# EAGLE design Linear-Temperature-Controller-bus-layout (EAGLE 6.5.0)

## Sheet 1 of 2
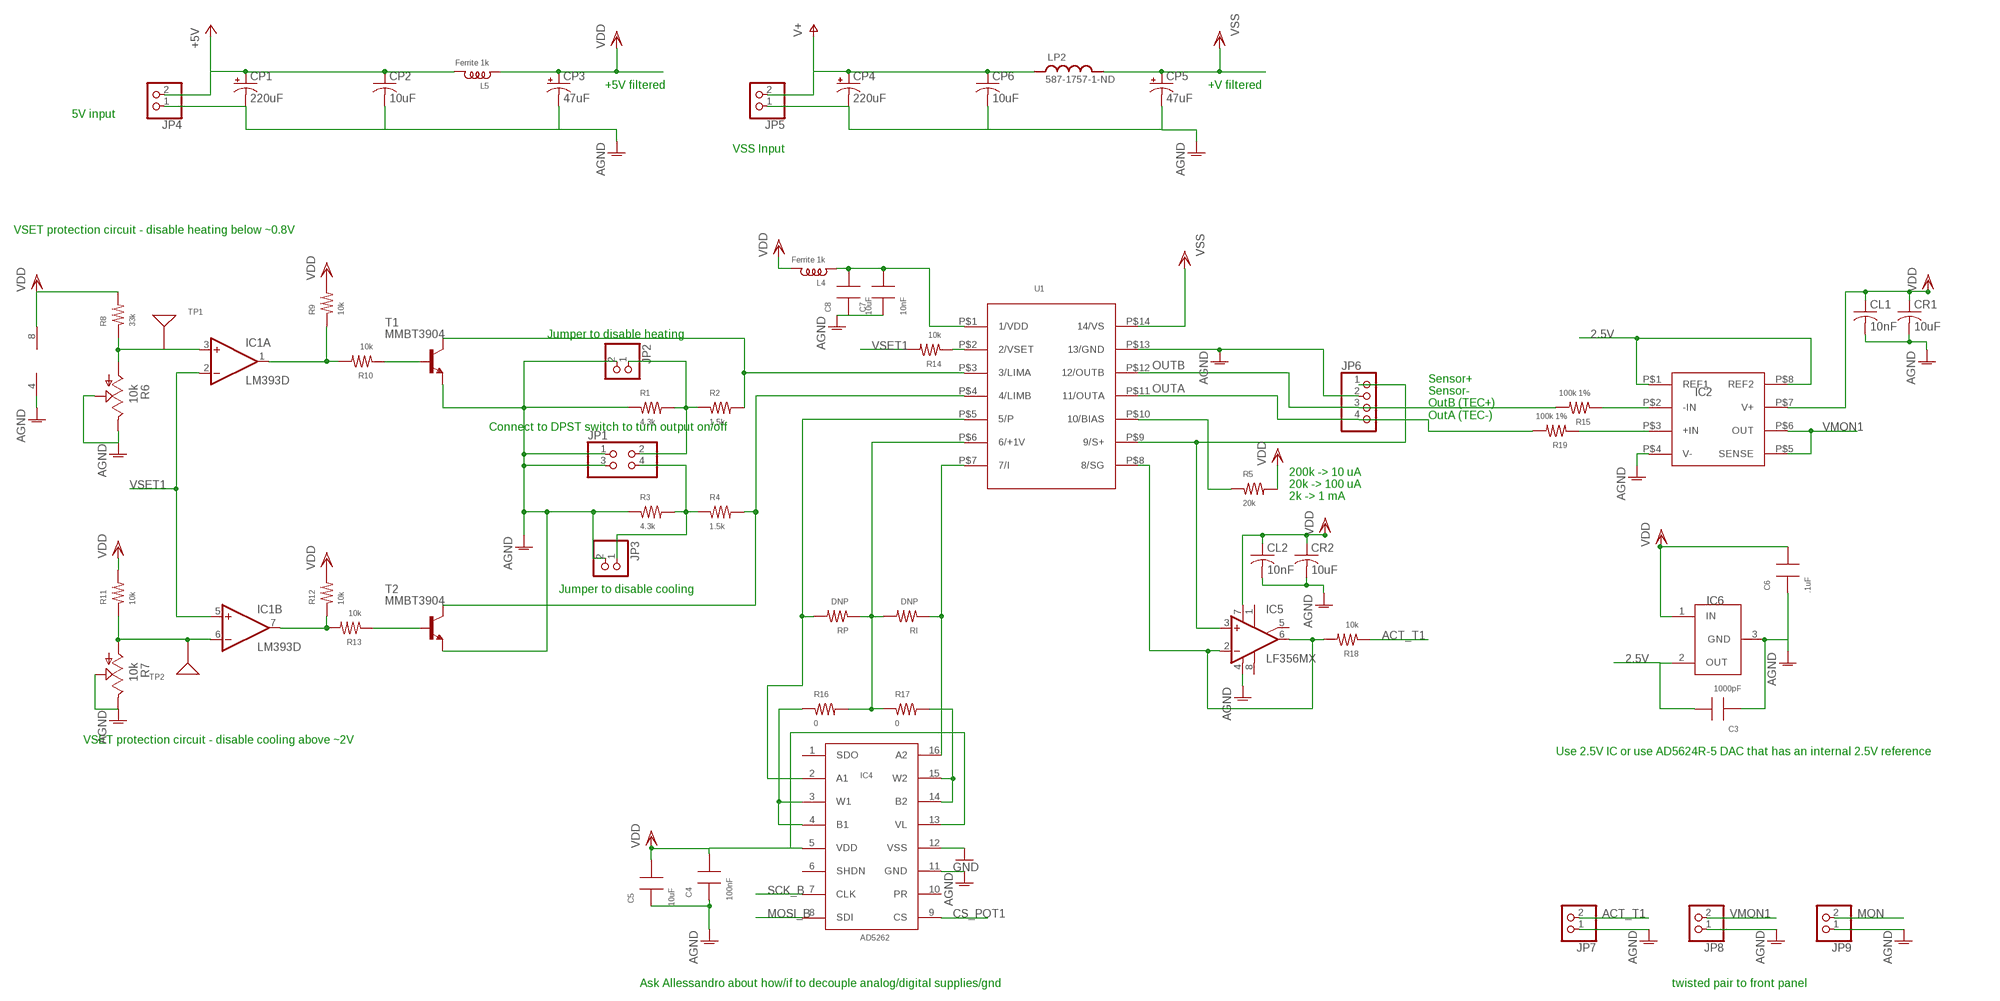
[diagram p0: schematic, sheet 1]

### Parts
C3  1000pF  CAP0805  [0805]
C4  100nF  CAP0805  [0805]
C5  10uF  CAP0805  [0805]
C6  .1uF  CAP0805  [0805]
C7  10nF  CAP0805  [0805]
C8  10uF  CAP0805  [0805]
CL1  10nF  C-USC0805  [C0805]
CL2  10nF  C-USC0805  [C0805]
CP1  220uF  CPOL-USF  [PANASONIC_F]
CP2  10uF  C-USC0805K  [C0805K]
CP3  47uF  CPOL-USCT7343  [CT7343]
CP4  220uF  CPOL-USF  [PANASONIC_F]
CP5  47uF  CPOL-USCT7343  [CT7343]
CP6  10uF  C-USC0805K  [C0805K]
CR1  10uF  C-USC0805  [C0805]
CR2  10uF  C-USC0805  [C0805]
IC1  LM393D  [SO08]
IC2  INA159  [VSSOP8]
IC4  AD5262  [TSSOP16]
IC5  LF356MX  OPAMP-SO  [SO08]
IC6  TS6001  [SOT-23]
JP1  PINHD-2X2  [2X02]
JP2  PINHD-1X2  [1X02]
JP3  PINHD-1X2  [1X02]
JP4  PINHD-1X2  [1X02]
JP5  PINHD-1X2  [1X02]
JP6  PINHD-1X4  [1X04]
JP7  PINHD-1X2  [1X02]
JP8  PINHD-1X2  [1X02]
JP9  PINHD-1X2  [1X02]
L4  Ferrite 1k  INDUCTOR-0805  [0805]
L5  Ferrite 1k  INDUCTOR-0805  [0805]
LP2  587-1757-1-ND  L_FERRITE_SMD  [L_FERRITE_1810]
R1  4.3k  RES0805  [0805]
R2  1.5k  RES0805  [0805]
R3  4.3k  RES0805  [0805]
R4  1.5k  RES0805  [0805]
R5  20k  RES0805  [0805]
R6  10k  64XR  [64XPOT]
R7  10k  64XR  [64XPOT]
R8  33k  RES0805  [0805]
R9  10k  RES0805  [0805]
R10  10k  RES0805  [0805]
R11  10k  RES0805  [0805]
R12  10k  RES0805  [0805]
R13  10k  RES0805  [0805]
R14  10k  RES0805  [0805]
R15  100k 1%  RES1206  [1206]
R16  0  RES0805  [0805]
R17  0  RES0805  [0805]
R18  10k  RES0805  [0805]
R19  100k 1%  RES1206  [1206]
RI  DNP  RES0805  [0805]
RP  DNP  RES0805  [0805]
T1  MMBT3904  [SOT-23]
T2  MMBT3904  [SOT-23]
TP1  TESTPT  [1206TESTPAD]
TP2  TESTPT  [1206TESTPAD]
U1  WTC3243  [WTC3293]

### Nets
2.5V: C3.2 IC2.P$1(REF1) IC2.P$8(REF2) IC6.2(OUT) ; also sheet 2
+5V: CP1.+ CP2.1 JP4.2 L5.2
ACT_T1: JP7.2 R18.1 ; also sheet 2
AGND: C3.1 C4.1 C5.1 C6.1 C7.1 C8.1 CL1.2 CL2.2 CP1.- CP2.2 CP3.- CP4.- CP5.- CP6.2 CR1.2 CR2.2 IC1.4(P:V-) IC2.P$4(V-) IC4.11(GND) IC5.4(V-) IC6.3(GND) JP1.1 JP1.3 JP2.2 JP3.2 JP4.1 JP5.1 JP6.2 JP7.1 JP8.1 JP9.1 R1.1 R3.1 R6.P$2 R6.P$3 R7.P$2 R7.P$3 T1.2(E) T2.2(E) U1.P$13(13/GND) ; also sheet 2
CS_POT1: IC4.9(CS) ; also sheet 2
DGND: IC4.12(VSS) ; supply symbol labelled GND ; also sheet 2
MON: JP9.2 ; also sheet 2
MOSI_B: IC4.8(SDI) ; also sheet 2
N$1: R2.2 T1.3(C) U1.P$3(3/LIMA)
N$2: JP1.2 JP2.1 R1.2 R2.1
N$3: R4.2 T2.3(C) U1.P$4(4/LIMB)
N$4: JP1.4 JP3.1 R3.2 R4.1
N$5: R5.1 U1.P$10(10/BIAS)
N$6: IC1.3(A:+IN) R6.P$1 R8.1 TP1.P$1
N$7: IC1.6(B:-IN) R7.P$1 R11.1 TP2.P$1
N$8: IC1.7(B:OUT) R12.1 R13.2
N$9: IC1.1(A:OUT) R9.1 R10.2
N$10: R10.1 T1.1(B)
N$11: R13.1 T2.1(B)
N$12: R14.1 U1.P$2(2/VSET)
N$13: IC5.3(+IN) JP6.1 U1.P$9(9/S+)
N$14: IC2.P$2(-IN) R15.1
N$15: IC4.2(A1) RP.2 U1.P$5(5/P)
N$16: IC2.P$3(+IN) R19.1
N$17: R16.2 R17.1 RI.2 RP.1 U1.P$6(6/+1V)
N$18: IC4.3(W1) IC4.4(B1) R16.1
N$19: IC4.16(A2) RI.1 U1.P$7(7/I)
N$20: IC4.14(B2) IC4.15(W2) R17.2
N$23: IC5.2(-IN) IC5.6(OUT) R18.2 U1.P$8(8/SG)
N$26: C7.2 C8.2 L4.1 U1.P$1(1/VDD)
OUTA: JP6.4 R19.2 U1.P$11(11/OUTA)
OUTB: JP6.3 R15.2 U1.P$12(12/OUTB)
SCK_B: IC4.7(CLK) ; also sheet 2
V+: CP4.+ CP6.1 JP5.2 LP2.P$1
VDD: C4.2 C5.2 C6.2 CL1.1 CL2.1 CP3.+ CR1.1 CR2.1 IC1.8(P:V+) IC2.P$7(V+) IC4.5(VDD) IC4.13(VL) IC5.7(V+) IC6.1(IN) L4.2 L5.1 R5.2 R8.2 R9.2 R11.2 R12.2 ; also sheet 2
VMON1: IC2.P$5(SENSE) IC2.P$6(OUT) JP8.2 ; also sheet 2
VSET1: IC1.2(A:-IN) IC1.5(B:+IN) R14.2 ; also sheet 2
VSS: CP5.+ LP2.P$2 U1.P$14(14/VS)
Unconnected: IC4.1(SDO) IC4.6(SHDN) IC4.10(PR) IC5.1(ON1) IC5.5(ON2) IC5.8(OPT)

### Notes on the sheet
- +5V filtered | +V filtered
- 5V input
- VSS Input
- VSET protection circuit - disable heating below ~0.8V
- Jumper to disable heating
- Sensor+
  Sensor-
  OutB (TEC+)
  OutA (TEC-)
- Connect to DPST switch to turn output on/off
- 200k -> 10 uA
  20k -> 100 uA
  2k -> 1 mA
- Jumper to disable cooling
- VSET protection circuit - disable cooling above ~2V
- Use 2.5V IC or use AD5624R-5 DAC that has an internal 2.5V reference
- Ask Allessandro about how/if to decouple analog/digital supplies/gnd | twisted pair to front panel

## Sheet 2 of 2
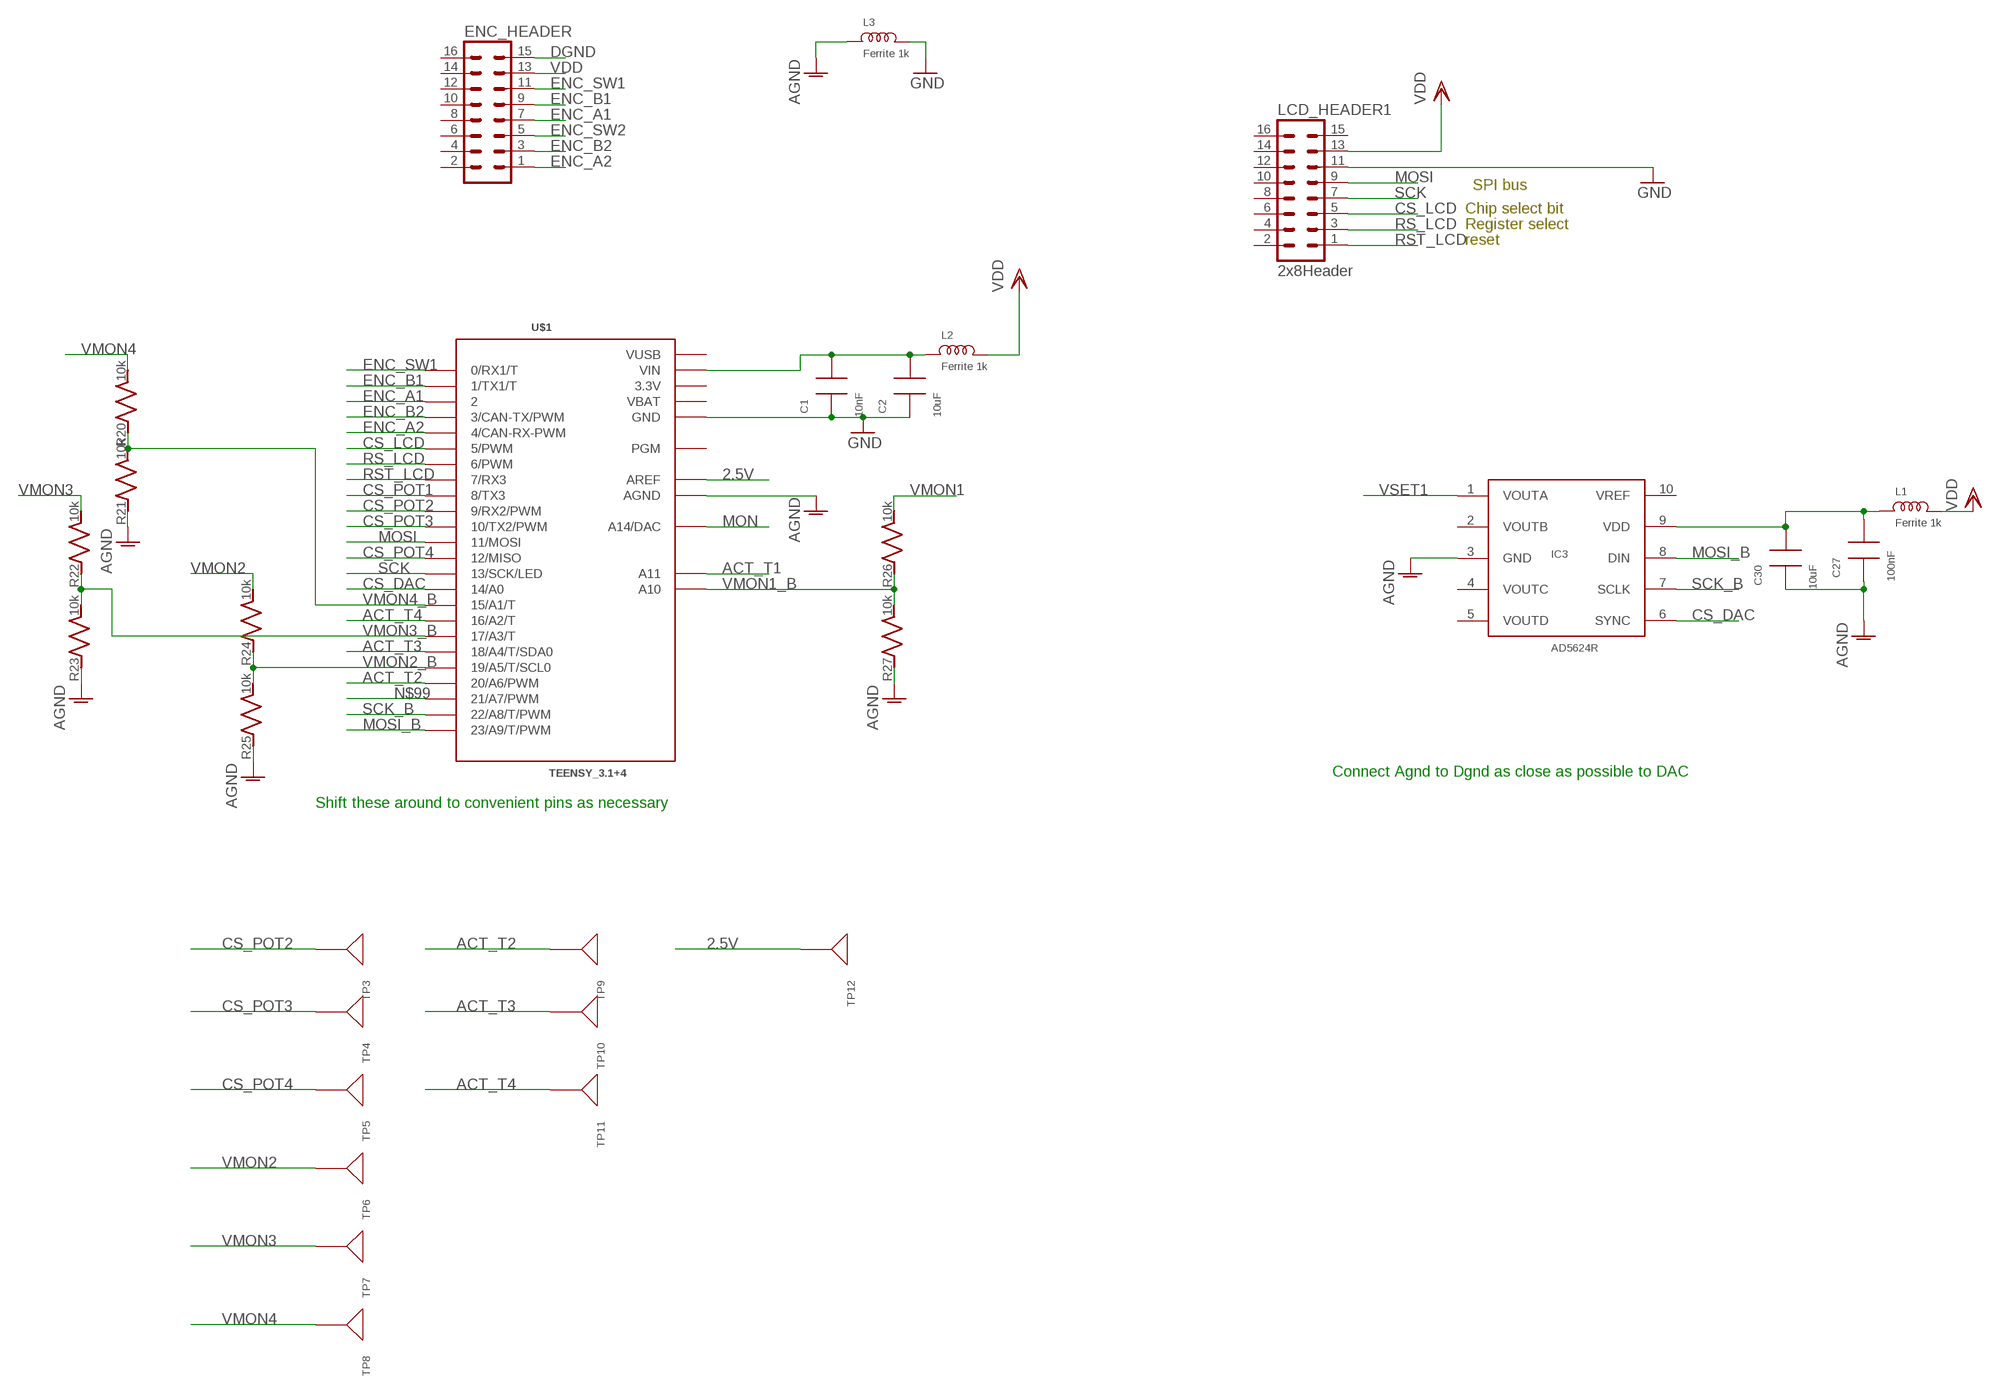
[diagram p1: schematic, sheet 2]

### Parts
C1  10nF  CAP0805  [0805]
C2  10uF  CAP0805  [0805]
C27  100nF  CAP0805  [0805]
C30  10uF  CAP0805  [0805]
ENC_HEADER  ML16  [ML16]
IC3  AD5624R  [MSOP10]
L1  Ferrite 1k  INDUCTOR-0805  [0805]
L2  Ferrite 1k  INDUCTOR-0805  [0805]
L3  Ferrite 1k  INDUCTOR-0805  [0805]
LCD_HEADER1  2x8Header  ML16  [ML16]
R20  10k  R_SMDR0805  [R_0805]
R21  10k  R_SMDR0805  [R_0805]
R22  10k  R_SMDR0805  [R_0805]
R23  10k  R_SMDR0805  [R_0805]
R24  10k  R_SMDR0805  [R_0805]
R25  10k  R_SMDR0805  [R_0805]
R26  10k  R_SMDR1206  [R_1206]
R27  10k  R_SMDR1206  [R_1206]
TP3  TESTPT  [1206TESTPAD]
TP4  TESTPT  [1206TESTPAD]
TP5  TESTPT  [1206TESTPAD]
TP6  TESTPT  [1206TESTPAD]
TP7  TESTPT  [1206TESTPAD]
TP8  TESTPT  [1206TESTPAD]
TP9  TESTPT  [1206TESTPAD]
TP10  TESTPT  [1206TESTPAD]
TP11  TESTPT  [1206TESTPAD]
TP12  TESTPT  [1206TESTPAD]
U$1  TEENSY_3.1+4  [TEENSY_3.1+4]

### Nets
2.5V: TP12.P$1 U$1.AREF ; also sheet 1
ACT_T1: U$1.A11 ; also sheet 1
ACT_T2: TP9.P$1 U$1.20/A6(20/A6/PWM)
ACT_T3: TP10.P$1 U$1.18/A4(18/A4/T/SDA0)
ACT_T4: TP11.P$1 U$1.16/A2(16/A2/T)
AGND: C27.1 C30.1 IC3.3(GND) L3.1 R21.P$1 R23.P$1 R25.P$1 R27.P$1 U$1.AGND ; also sheet 1
CS_DAC: IC3.6(SYNC) U$1.14/A0
CS_LCD: LCD_HEADER1.5 U$1.5(5/PWM)
CS_POT1: U$1.8(8/TX3) ; also sheet 1
CS_POT2: TP3.P$1 U$1.9(9/RX2/PWM)
CS_POT3: TP4.P$1 U$1.10(10/TX2/PWM)
CS_POT4: TP5.P$1 U$1.12(12/MISO)
DGND: C1.1 C2.1 ENC_HEADER.15 L3.2 LCD_HEADER1.11 U$1.GND U$1.GND1(GND) ; supply symbol labelled GND ; also sheet 1
ENC_A1: ENC_HEADER.7 U$1.2
ENC_A2: ENC_HEADER.1 U$1.4(4/CAN-RX-PWM)
ENC_B1: ENC_HEADER.9 U$1.1(1/TX1/T)
ENC_B2: ENC_HEADER.3 U$1.3(3/CAN-TX/PWM)
ENC_SW1: ENC_HEADER.11 U$1.0(0/RX1/T)
ENC_SW2: ENC_HEADER.5
MON: U$1.A14(A14/DAC) ; also sheet 1
MOSI: LCD_HEADER1.9 U$1.11(11/MOSI)
MOSI_B: IC3.8(DIN) U$1.23/A9(23/A9/T/PWM) ; also sheet 1
N$24: C27.2 C30.2 IC3.9(VDD) L1.1
N$25: C1.2 C2.2 L2.1 U$1.VIN
N$99: U$1.21/A7(21/A7/PWM)
RS_LCD: LCD_HEADER1.3 U$1.6(6/PWM)
RST_LCD: LCD_HEADER1.1 U$1.7(7/RX3)
SCK: LCD_HEADER1.7 U$1.13(13/SCK/LED)
SCK_B: IC3.7(SCLK) U$1.22/A8(22/A8/T/PWM) ; also sheet 1
VDD: ENC_HEADER.13 L1.2 L2.2 LCD_HEADER1.13 ; also sheet 1
VMON1: R26.P$2 ; also sheet 1
VMON1_B: R26.P$1 R27.P$2 U$1.A10
VMON2: R24.P$2 TP6.P$1
VMON2_B: R24.P$1 R25.P$2 U$1.19/A5(19/A5/T/SCL0)
VMON3: R22.P$2 TP7.P$1
VMON3_B: R22.P$1 R23.P$2 U$1.17/A3(17/A3/T)
VMON4: R20.P$2 TP8.P$1
VMON4_B: R20.P$1 R21.P$2 U$1.15/A1(15/A1/T)
VSET1: IC3.1(VOUTA) ; also sheet 1
Unconnected: ENC_HEADER.2 ENC_HEADER.4 ENC_HEADER.6 ENC_HEADER.8 ENC_HEADER.10 ENC_HEADER.12 ENC_HEADER.14 ENC_HEADER.16 IC3.2(VOUTB) IC3.4(VOUTC) IC3.5(VOUTD) IC3.10(VREF) LCD_HEADER1.2 LCD_HEADER1.4 LCD_HEADER1.6 LCD_HEADER1.8 LCD_HEADER1.10 LCD_HEADER1.12 LCD_HEADER1.14 LCD_HEADER1.15 LCD_HEADER1.16 U$1.PGM

### Notes on the sheet
- SPI bus
- Chip select bit
- Register select
- reset
- Connect Agnd to Dgnd as close as possible to DAC
- Shift these around to convenient pins as necessary

## Power pins joined to a net without a drawn wire
3.3V: U$1.3.3V U$1.3.3V1(3.3V)
VBAT: U$1.VBAT
VUSB: U$1.VUSB

## Library data of the parts
C1-C8 C27 C30 = rlc-jqi:CAP: SMT Capacitor
CL1 CL2 CP2 CP6 CR1 CR2 = rcl:C-US: CAPACITOR, American symbol
CP1 CP3-CP5 = rcl:CPOL-US: POLARIZED CAPACITOR, American symbol
ENC_HEADER = aom_driver:ML16: HARTING 2x8 (16 pin) ribbon connector.; OC_FARNELL: unknown; OC_NEWARK: unknown
IC1 = Lin-Temp-Controller:LM393: COMPARATOR
IC2 = Lin-Temp-Controller:INA159: INA159 Difference Amplifier, Texas Instruments; DIGIKEY: 296-18688-1-ND
IC3 = Lin-Temp-Controller:AD5624R: AD5624R Quad Output DAC w/internal Vref; DIGIKEY: AD5624RBRMZ-3-ND
IC4 = Lin-Temp-Controller:AD5262: AD5262 dual circuit digital pot
IC5 = opamp-jqi:OPAMP: Basic Op Amp. Be sure to check actual pinout of your device, and modify as necessary!
IC6 = Lin-Temp-Controller:TS6001: 2.5V Reference IC; DIGIKEY: TS6001BIG325TCT-ND
JP1 = pinhead:PINHD-2X2: PIN HEADER
JP2-JP5 JP7-JP9 = pinhead:PINHD-1X2: PIN HEADER
JP6 = pinhead:PINHD-1X4: PIN HEADER
L1-L5 = rlc-jqi:INDUCTOR: SMT Inductor.
LCD_HEADER1 = mcu-accessories:ML16: HARTING 2x8 (16 pin) ribbon connector.; OC_FARNELL: unknown; OC_NEWARK: unknown; PARTNO: S9171-ND
LP2 = jqi_passives:L_FERRITE_SMD
R1-R5 R8-R19 RI RP = rlc-jqi:RES: SMT Resistor
R6 R7 = Lin-Temp-Controller:64XR; DIGIKEY: 987-1068-ND
R20-R27 = jqi_passives:R_SMD
T1 T2 = Lin-Temp-Controller:MMBT3904: NPN TRANSISTOR
TP1-TP12 = Lin-Temp-Controller:TESTPT
U1 = Lin-Temp-Controller:WTC3243
U$1 = mcu-accessories:TEENSY_3.1+4: Footprint for Teensy 3.1 board using all through-holes, i.e. the entire perimeter plus the 4 through-holes inboard (A10,A11,AREF, VUSB)

## Board
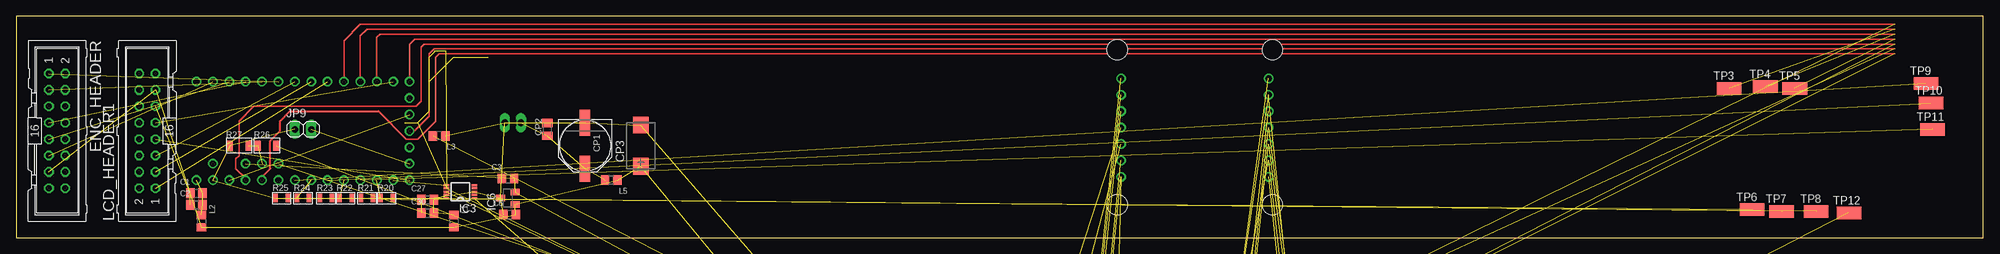
[diagram p2: board, top side]
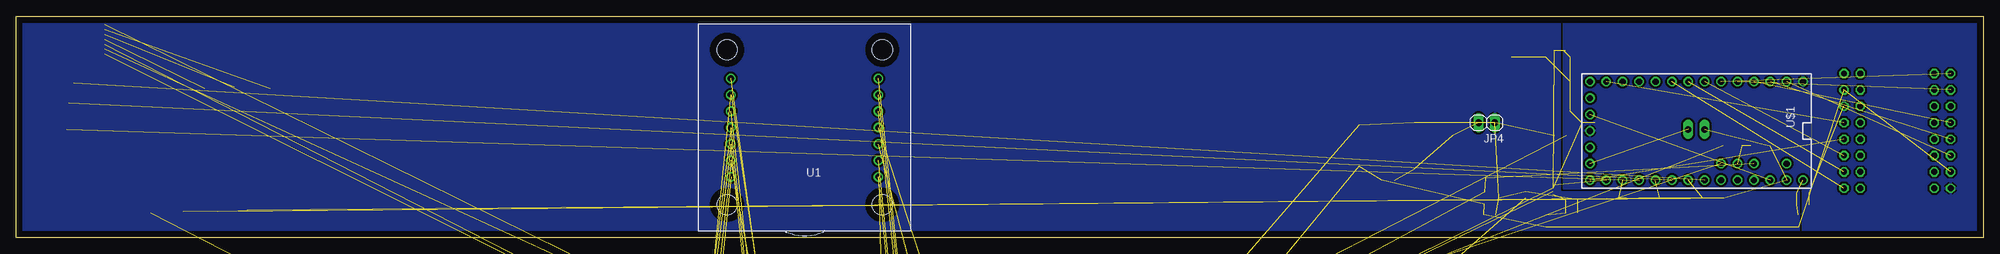
[diagram p3: board, bottom side, seen from below]

Size 304.8 x 34.29 mm. Coordinates in mm from the lower left corner, seen from the top.
Outline: 0,0 304.8,0 304.8,34.29 0,34.29 0,0
Copper layers (1*16): Top 0.035mm / dielectric 1.5mm / Bottom 0.035mm
Design rules "default": minimum track width 10mil, minimum drill 24mil, track to track 8mil, track to pad 8mil, pad to pad 8mil, via to via 8mil, smd to smd 8mil, copper to edge 40mil, drill to drill 8mil, minimum pad ring 10mil, minimum via ring 8mil, stop-mask expansion 4mil, vias tented up to drill 0mil, thermal gap 10mil

### Footprints (pad centres in the part's own frame; a part is rotated, then mirrored left to right if it is on the bottom)
0805 = smd 1.3 x 1.5: 1 -0.95,0; 2 0.95,0
C0805 = smd 1.3 x 1.5: 1 -0.95,0; 2 0.95,0
PANASONIC_F = smd 4 x 1.6: + 3.55,0; - -3.55,0
C0805K = smd 1.3 x 1.6: 1 -1,0; 2 1,0
CT7343 = smd 2.6 x 2.4: + -3.2,0; - 3.2,0
ML16 = drill 0.914 octagon: 1 -8.89,-1.27; 2 -8.89,1.27; 3 -6.35,-1.27; 4 -6.35,1.27; 5 -3.81,-1.27; 6 -3.81,1.27; 7 -1.27,-1.27; 8 -1.27,1.27; 9 1.27,-1.27; 10 1.27,1.27; 11 3.81,-1.27; 12 3.81,1.27; 13 6.35,-1.27; 14 6.35,1.27; 15 8.89,-1.27; 16 8.89,1.27
SO08 = smd 0.6 x 2.2: 1 -1.905,-2.6; 2 -0.635,-2.6; 3 0.635,-2.6; 4 1.905,-2.6; 5 1.905,2.6; 6 0.635,2.6; 7 -0.635,2.6; 8 -1.905,2.6
VSSOP8 = smd 0.45 x 1.45: P$1 -0.975,-2.2; P$2 -0.325,-2.2; P$3 0.325,-2.2; P$4 0.972,-2.2; P$5 0.975,2.2; P$6 0.325,2.2; P$7 -0.325,2.2; P$8 -0.975,2.2
MSOP10 = smd 0.9 x 0.3: 1 -2.16,1; 2 -2.16,0.5; 3 -2.16,0; 4 -2.16,-0.5; 5 -2.16,-1; 6 2.16,-1; 7 2.16,-0.5; 8 2.16,0; 9 2.16,0.5; 10 2.16,1
TSSOP16 = smd 0.9 x 0.35: 1 -2.875,2.275; 2 -2.875,1.625; 3 -2.875,0.975; 4 -2.875,0.325; 5 -2.875,-0.325; 6 -2.875,-0.975; 7 -2.875,-1.625; 8 -2.875,-2.275; 9 2.875,-2.275; 10 2.875,-1.625; 11 2.875,-0.975; 12 2.875,-0.325; 13 2.875,0.325; 14 2.875,0.975; 15 2.875,1.625; 16 2.875,2.275
SO08' = smd 2.2 x 0.6: 1 -2.6,1.27; 2 -2.6,0; 3 -2.6,-1.27; 4 -2.6,-2.54; 5 2.6,-2.54; 6 2.6,-1.27; 7 2.6,0; 8 2.6,1.27
SOT-23 = smd 1 x 1.4: 1 -0.95,-1.1; 2 0.95,-1.1; 3 0,1.1
2X02 = drill 1.016 octagon: 1 -1.27,-1.27; 2 -1.27,1.27; 3 1.27,-1.27; 4 1.27,1.27
1X02 = drill 1.016 long: 1 -1.27,0; 2 1.27,0
1X04 = drill 1.016 long: 1 -3.81,0; 2 -1.27,0; 3 1.27,0; 4 3.81,0
L_FERRITE_1810 = smd 1.75 x 2.9: P$1 -1.75,0; P$2 1.75,0
64XPOT = drill 0.8: P$1 -1.27,2.54; P$2 1.27,0; P$3 -1.27,-2.54
1206 = smd 1.6 x 1.803: 1 -1.422,0; 2 1.422,0
R_0805 = smd 0.7 x 1.3: P$1 -0.95,0; P$2 0.95,0
R_1206 = smd 0.9 x 1.6: P$1 -1.45,0; P$2 1.45,0
1206TESTPAD = smd 3.81 x 1.93: P$1 0,0
WTC3293 = drill 0.965: P$1 -11.43,7.62; P$2 -11.43,5.08; P$3 -11.43,2.54; P$4 -11.43,0; P$5 -11.43,-2.54; P$6 -11.43,-5.08; P$7 -11.43,-7.62; P$8 11.43,-7.62; P$9 11.43,-5.08; P$10 11.43,-2.54; P$11 11.43,0; P$12 11.43,2.54; P$13 11.43,5.08; P$14 11.43,7.62 | hole 3.175: -12.014,11.938; 12.014,11.938; 12.014,-12.065; -12.014,-12.065
TEENSY_3.1+4 = drill 0.965: 0 -7.62,15.24; 1 -7.62,12.7; 2 -7.62,10.16; 3 -7.62,7.62; 3.3V 7.62,12.7; 3.3V1 -2.54,-15.24; 4 -7.62,5.08; 5 -7.62,2.54; 6 -7.62,0; 7 -7.62,-2.54; 8 -7.62,-5.08; 9 -7.62,-7.62; 10 -7.62,-10.16; 11 -7.62,-12.7; 12 -7.62,-15.24; 13 7.62,-15.24; 14/A0 7.62,-12.7; 15/A1 7.62,-10.16; 16/A2 7.62,-7.62; 17/A3 7.62,-5.08; 18/A4 7.62,-2.54; 19/A5 7.62,0; 20/A6 7.62,2.54; 21/A7 7.62,5.08; 22/A8 7.62,7.62; 23/A9 7.62,10.16; A10 5.08,7.62; A11 5.08,5.08; A14 5.08,-15.24; AGND 7.62,15.24; AREF 5.08,10.16; GND -7.62,17.78; GND1 0,-15.24; PGM 2.54,-15.24; VBAT -5.08,-15.24; VIN 7.62,17.78; VUSB 5.08,15.24

### Placement (x,y rotation side)
C1  27.94,6.86 0 top
C2  27.94,5.08 0 top
C3  76.2,9.14 0 top
C4  155.96,-41.15 90 top  (outside the outline)
C5  158.24,-41.15 90 top  (outside the outline)
C6  76.45,3.56 0 top
C7  170.69,-47.24 180 top  (outside the outline)
C8  170.69,-49.28 180 top  (outside the outline)
C27  63.75,5.84 0 top
C30  63.75,3.81 0 top
CL1  178.31,-50.29 270 top  (outside the outline)
CL2  178.56,-28.19 90 top  (outside the outline)
CP1  88.14,14.22 270 top
CP2  82.3,16.76 90 top
CP3  96.77,14.22 90 top
CP4  208.28,-44.45 180 top  (outside the outline)
CP5  200.66,-50.8 90 top  (outside the outline)
CP6  208.28,-38.1 0 top  (outside the outline)
CR1  176.02,-50.29 270 top  (outside the outline)
CR2  176.53,-28.19 90 top  (outside the outline)
ENC_HEADER  6.35,16.51 270 top
IC1  130.05,-48.77 180 top  (outside the outline)
IC2  181.36,-46.74 90 top  (outside the outline)
IC3  68.83,7.11 180 top
IC4  156.97,-34.8 90 top  (outside the outline)
IC5  LF356MX  [SO08']  184.15,-28.19 180 top  (outside the outline)
IC6  76.2,6.1 90 top
JP1  152.15,-43.69 90 top  (outside the outline)
JP2  151.38,-51.31 270 top  (outside the outline)
JP3  147.32,-43.94 270 top  (outside the outline)
JP4  76.96,17.78 180 bottom
JP5  208.28,-34.29 0 bottom  (outside the outline)
JP6  200.66,-39.37 90 top  (outside the outline)
JP7  172.47,-33.02 0 top  (outside the outline)
JP8  172.21,-38.1 0 top  (outside the outline)
JP9  44.45,16.76 0 top
L1  67.82,2.54 270 top
L2  28.7,2.54 270 top
L3  65.53,15.75 180 top
L4  164.59,-47.24 180 top  (outside the outline)
L5  92.2,8.89 180 top
LCD_HEADER1  20.32,16.51 90 top
LP2  205.74,-52.07 270 top  (outside the outline)
R1  150.37,-47.75 0 top  (outside the outline)
R2  154.43,-48.01 270 top  (outside the outline)
R3  148.08,-39.62 0 top  (outside the outline)
R4  151.89,-39.62 0 top  (outside the outline)
R5  186.69,-36.83 180 top  (outside the outline)
R6  132.59,-27.94 180 top  (outside the outline)
R7  140.46,-27.94 180 top  (outside the outline)
R8  134.11,-33.27 270 top  (outside the outline)
R9  136.4,-48.01 180 top  (outside the outline)
R10  140.21,-48.01 180 top  (outside the outline)
R11  141.73,-33.27 270 top  (outside the outline)
R12  134.87,-40.39 180 top  (outside the outline)
R13  138.68,-40.39 180 top  (outside the outline)
R14  164.59,-44.45 180 top  (outside the outline)
R15  186.69,-41.91 0 top  (outside the outline)
R16  162.56,-36.83 90 top  (outside the outline)
R17  162.56,-33.02 90 top  (outside the outline)
R18  177.55,-24.89 0 top  (outside the outline)
R19  186.69,-39.37 0 top  (outside the outline)
R20  57.4,6.1 0 top
R21  54.36,6.1 0 top
R22  51.05,6.1 0 top
R23  48.01,6.1 0 top
R24  44.45,6.1 0 top
R25  41.15,6.1 0 top
R26  38.86,14.22 0 top
R27  34.54,14.22 0 top
RI  165.1,-33.02 270 top  (outside the outline)
RP  165.1,-36.83 270 top  (outside the outline)
T1  144.53,-49.02 270 top  (outside the outline)
T2  143.26,-41.4 270 top  (outside the outline)
TP1  127.51,-24.64 0 top  (outside the outline)
TP2  145.8,-25.4 0 top  (outside the outline)
TP3  265.43,23.11 0 top
TP4  271.02,23.37 0 top
TP5  275.59,23.11 0 top
TP6  268.99,4.32 0 top
TP7  273.56,4.06 0 top
TP8  278.89,4.06 0 top
TP9  295.91,23.88 0 top
TP10  296.67,20.83 0 top
TP11  296.93,16.76 0 top
TP12  283.97,3.81 0 top
U1  182.63,17.02 180 bottom
U$1  45.72,16.51 270 bottom

### Tracks (layer width: path | path; a pad name or v marks a point on that pad's centre or on a via)
2.5V  (5 unrouted)
3.3V  (1 unrouted)
+5V  (3 unrouted)
ACT_T1  (2 unrouted)
ACT_T2  (1 unrouted)
ACT_T3  (1 unrouted)
ACT_T4  (1 unrouted)
AGND  (48 unrouted)
  pour Bottom (isolate 0.305, rank 2): 27.94,34.04 304.8,34.29 304.8,0 28.19,-0.25
CS_DAC  (1 unrouted)
CS_LCD  (1 unrouted)
CS_POT1  (1 unrouted)
  Top 0.254: U$1.8 50.8,30.48 53.34,33.02 291.08,33.02
CS_POT2  (1 unrouted)
  Top 0.254: U$1.9 53.34,31.24 54.36,32.26 291.08,32.26
CS_POT3  (1 unrouted)
  Top 0.254: U$1.10 55.88,30.99 56.39,31.5 291.08,31.5
CS_POT4  (1 unrouted)
  Top 0.254: U$1.12 60.96,29.97 61.72,30.73 291.08,30.73
DGND  (4 unrouted)
  Top 0.254: U$1.GND1 61.72,16.51 64.01,18.8 64.01,28.45 64.77,29.21 291.08,29.21
  pour Bottom (isolate 0.305): 0,34.29 0,-0.25 27.94,-0.25 27.94,7.62 65.02,7.62 65.02,34.29
ENC_A1  (1 unrouted)
ENC_A2  (1 unrouted)
ENC_B1  (1 unrouted)
ENC_B2  (1 unrouted)
ENC_SW1  (1 unrouted)
MON  (1 unrouted)
MOSI  (1 unrouted)
MOSI_B  (2 unrouted)
  Top 0.254: U$1.23/A9 35.56,9.14 34.04,10.67 34.04,12.19 34.54,12.7 34.54,18.03 36.83,20.32 61.98,20.32 62.74,21.08 62.74,29.46 63.25,29.97 291.08,29.97
N$1  (2 unrouted)
N$2  (3 unrouted)
N$3  (2 unrouted)
N$4  (3 unrouted)
N$5  (1 unrouted)
N$6  (3 unrouted)
N$7  (3 unrouted)
N$8  (2 unrouted)
N$9  (2 unrouted)
N$10  (1 unrouted)
N$11  (1 unrouted)
N$12  (1 unrouted)
N$13  (2 unrouted)
N$14  (1 unrouted)
N$15  (2 unrouted)
N$16  (1 unrouted)
N$17  (4 unrouted)
N$18  (2 unrouted)
N$19  (2 unrouted)
N$20  (2 unrouted)
N$23  (3 unrouted)
N$24  (3 unrouted)
N$25  (3 unrouted)
N$26  (3 unrouted)
OUTA  (2 unrouted)
OUTB  (2 unrouted)
RS_LCD  (1 unrouted)
RST_LCD  (1 unrouted)
SCK  (1 unrouted)
SCK_B  (13 unrouted)
  Top 0.254: 56.13,19.56 60.45,15.24 62.23,15.24 65.02,18.03 65.02,27.94 65.53,28.45 291.08,28.45
  Top 0.305: U$1.22/A8 38.1,9.4 39.37,10.67 39.37,14.99 40.89,16.51 40.89,18.03 42.42,19.56 56.13,19.56
V+  (3 unrouted)
VDD  (24 unrouted)
VMON1  (3 unrouted)
VMON1_B  (2 unrouted)
VMON2  (1 unrouted)
VMON2_B  (2 unrouted)
VMON3  (1 unrouted)
VMON3_B  (2 unrouted)
VMON4  (1 unrouted)
VMON4_B  (2 unrouted)
VSET1  (3 unrouted)
VSS  (2 unrouted)